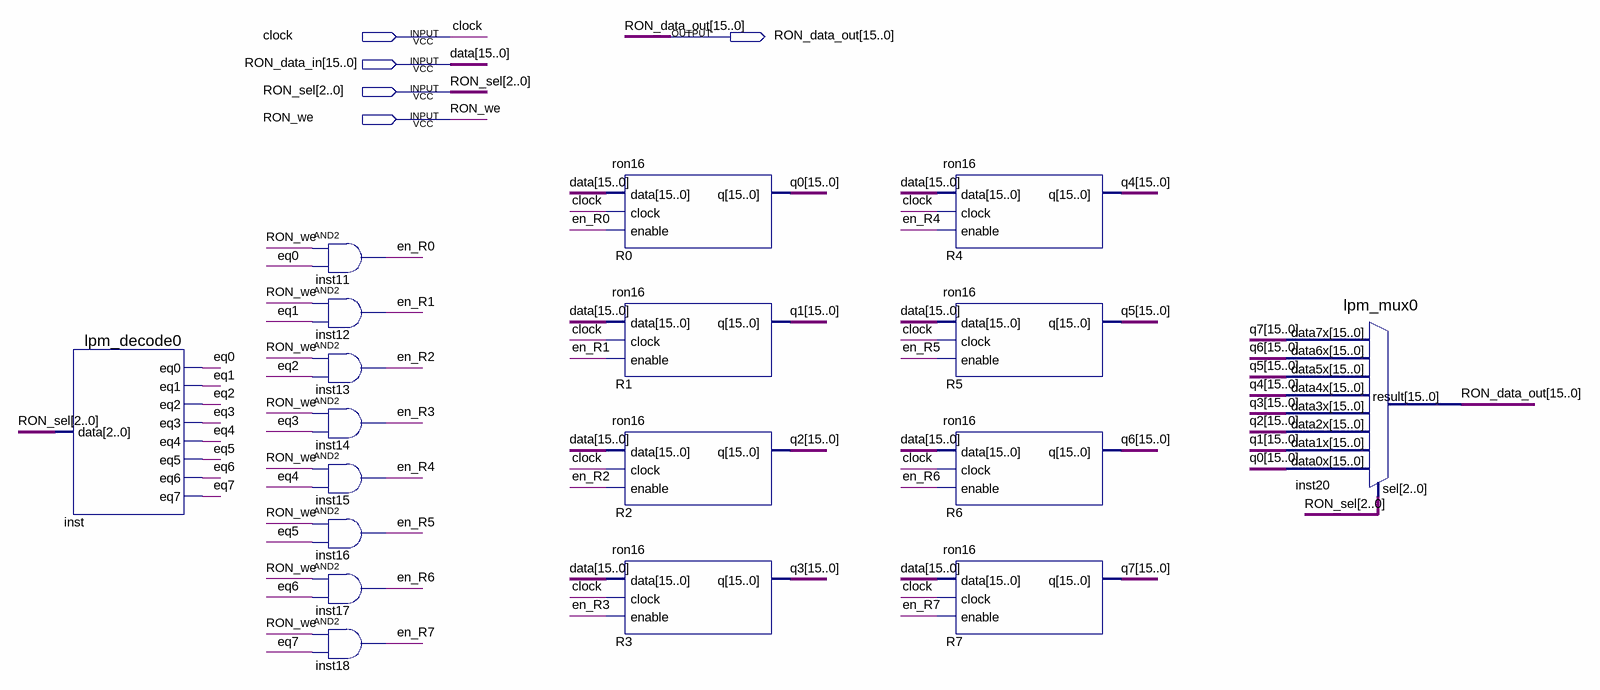
[diagram p0: schematic sheet]
// Quartus schematic ron_unit.bdf as structural Verilog: 18 symbols, 5 pins
module ron_unit (
  input  clock,
  input  [15:0] RON_data_in,
  input  [2:0] RON_sel,
  input  RON_we,
  output [15:0] RON_data_out
);

  wire en_R0, en_R1, en_R2, en_R3, en_R4, en_R5, en_R6, en_R7, eq0, eq1, eq2, eq3, eq4, eq5, eq6, eq7;
  wire [15:0] q0, q1, q2, q3, q4, q5, q6, q7;

  lpm_decode0 inst (
    .data(RON_sel), .eq0(eq0), .eq1(eq1), .eq2(eq2), .eq3(eq3), .eq4(eq4), .eq5(eq5), .eq6(eq6), .eq7(eq7));
  and inst11 (en_R0, RON_we, eq0);
  and inst12 (en_R1, RON_we, eq1);
  and inst13 (en_R2, RON_we, eq2);
  and inst14 (en_R3, RON_we, eq3);
  and inst15 (en_R4, RON_we, eq4);
  and inst16 (en_R5, RON_we, eq5);
  and inst17 (en_R6, RON_we, eq6);
  and inst18 (en_R7, RON_we, eq7);
  ron16 R0 (.data(RON_data_in), .clock(clock), .enable(en_R0), .q(q0));
  ron16 R1 (.data(RON_data_in), .clock(clock), .enable(en_R1), .q(q1));
  ron16 R2 (.data(RON_data_in), .clock(clock), .enable(en_R2), .q(q2));
  ron16 R3 (.data(RON_data_in), .clock(clock), .enable(en_R3), .q(q3));
  ron16 R4 (.data(RON_data_in), .clock(clock), .enable(en_R4), .q(q4));
  ron16 R5 (.data(RON_data_in), .clock(clock), .enable(en_R5), .q(q5));
  ron16 R6 (.data(RON_data_in), .clock(clock), .enable(en_R6), .q(q6));
  ron16 R7 (.data(RON_data_in), .clock(clock), .enable(en_R7), .q(q7));
  lpm_mux0 inst20 (
    .data7x(q7), .data6x(q6), .data5x(q5), .data4x(q4), .data3x(q3), .data2x(q2), .data1x(q1), .data0x(q0),
    .sel(RON_sel), .result(RON_data_out));

  // Other names for the same wires on the sheet: data[15:0] = RON_data_in
endmodule
